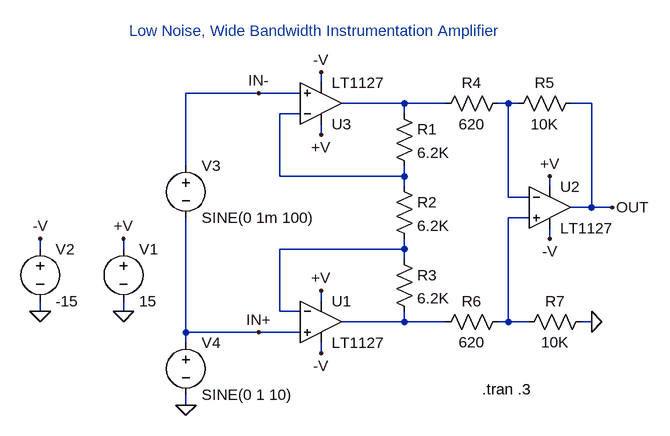
[diagram p0: schematic LT1127.asc]
LT1127.asc, the LTspice schematic file:
Version 4
SHEET 1 896 680
WIRE 176 -48 176 -64
WIRE 80 -32 -32 -32
WIRE 144 -32 80 -32
WIRE 304 -16 208 -16
WIRE 368 -16 304 -16
WIRE 464 -16 448 -16
WIRE 480 -16 464 -16
WIRE 592 -16 560 -16
WIRE 144 0 112 0
WIRE 304 0 304 -16
WIRE 176 32 176 16
WIRE -32 80 -32 -32
WIRE 112 96 112 0
WIRE 304 96 304 80
WIRE 304 96 112 96
WIRE 304 112 304 96
WIRE 528 112 528 96
WIRE 464 128 464 -16
WIRE 496 128 464 128
WIRE 592 144 592 -16
WIRE 592 144 560 144
WIRE 624 144 592 144
WIRE 496 160 464 160
WIRE 528 192 528 176
WIRE -256 208 -256 192
WIRE -128 208 -128 192
WIRE 304 208 304 192
WIRE 304 208 112 208
WIRE 304 224 304 208
WIRE 176 288 176 272
WIRE -256 304 -256 288
WIRE -128 304 -128 288
WIRE 112 304 112 208
WIRE 144 304 112 304
WIRE 304 320 304 304
WIRE 304 320 208 320
WIRE 368 320 304 320
WIRE 464 320 464 160
WIRE 464 320 448 320
WIRE 496 320 464 320
WIRE 592 320 576 320
WIRE -32 336 -32 160
WIRE 80 336 -32 336
WIRE 144 336 80 336
WIRE -32 352 -32 336
WIRE 176 368 176 352
WIRE -32 448 -32 432
FLAG -128 304 0
FLAG 176 272 +V
FLAG -128 192 +V
FLAG 176 368 -V
FLAG -256 304 0
FLAG -256 192 -V
FLAG -32 448 0
FLAG 528 96 +V
FLAG 528 192 -V
FLAG 176 32 +V
FLAG 176 -64 -V
FLAG 592 320 0
FLAG 624 144 OUT
FLAG 80 336 IN+
FLAG 80 -32 IN-
SYMBOL voltage -128 192 R0
SYMATTR InstName V1
SYMATTR Value 15
SYMBOL voltage -256 192 R0
SYMATTR InstName V2
SYMATTR Value -15
SYMBOL voltage -32 64 R0
SYMATTR InstName V3
SYMATTR Value SINE(0 1m 100)
SYMBOL opamps\\LT1127 176 256 R0
SYMATTR InstName U1
SYMBOL opamps\\LT1127 528 80 R0
SYMATTR InstName U2
SYMBOL opamps\\LT1127 176 48 M180
SYMATTR InstName U3
SYMBOL res 288 -16 R0
SYMATTR InstName R1
SYMATTR Value 6.2K
SYMBOL res 288 96 R0
SYMATTR InstName R2
SYMATTR Value 6.2K
SYMBOL res 288 208 R0
SYMATTR InstName R3
SYMATTR Value 6.2K
SYMBOL res 464 -32 R90
WINDOW 0 0 56 VBottom 2
WINDOW 3 32 56 VTop 2
SYMATTR InstName R4
SYMATTR Value 620
SYMBOL res 576 -32 R90
WINDOW 0 0 56 VBottom 2
WINDOW 3 32 56 VTop 2
SYMATTR InstName R5
SYMATTR Value 10K
SYMBOL res 464 304 R90
WINDOW 0 0 56 VBottom 2
WINDOW 3 32 56 VTop 2
SYMATTR InstName R6
SYMATTR Value 620
SYMBOL res 592 304 R90
WINDOW 0 0 56 VBottom 2
WINDOW 3 32 56 VTop 2
SYMATTR InstName R7
SYMATTR Value 10K
SYMBOL voltage -32 336 R0
SYMATTR InstName V4
SYMATTR Value SINE(0 1 10)
TEXT 424 424 Left 2 !.tran .3
TEXT 168 -112 Bottom 2 ;Low Noise, Wide Bandwidth Instrumentation Amplifier

The netlist it stands for:
* LT1127.asc
V1 +V 0 15
V2 -V 0 -15
V3 IN- IN+ SINE(0 1m 100)
XU1 IN+ N005 +V -V N006 LT1127  ; pins In+ In- V+ V- OUT
XU2 N004 N002 +V -V OUT LT1127  ; pins In+ In- V+ V- OUT
XU3 IN- N003 +V -V N001 LT1127  ; pins In+ In- V+ V- OUT
R1 N001 N003 6.2K
R2 N003 N005 6.2K
R3 N005 N006 6.2K
R4 N002 N001 620
R5 OUT N002 10K
R6 N004 N006 620
R7 0 N004 10K
V4 IN+ 0 SINE(0 1 10)
.tran .3
* Low Noise, Wide Bandwidth Instrumentation Amplifier
.backanno
.end